# Altium schematic sheet MID_CURR_MOS.SchDoc
size A4; SheetNumber: 7; SheetTotal: 14
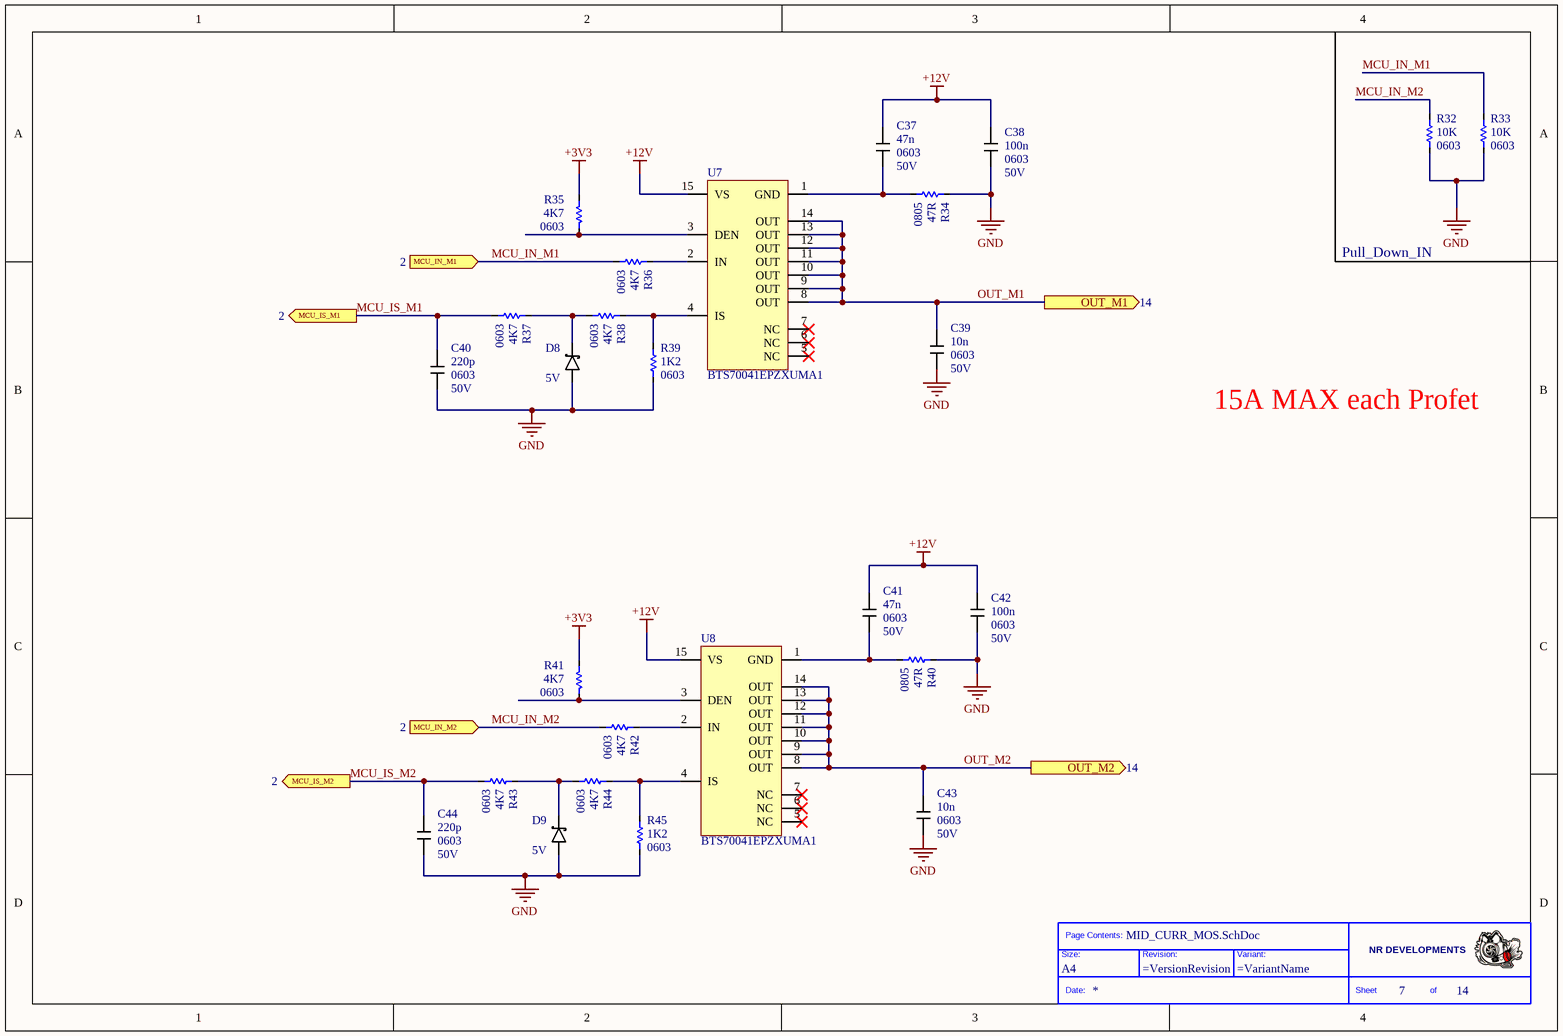
[diagram p0: MID_CURR_MOS.SchDoc]

## Parts
*?  Size: A4  (hidden comment: Title_Block)  (graphical)
C37  value 47n  Case: 0603  Voltage: 50V  [CAPC1608X09M]  (hidden comment: CAP)
C38  value 100n  Case: 0603  Voltage: 50V  [CAPC1608X09M]  (hidden comment: CAP)
C39  value 10n  Case: 0603  Voltage: 50V  [CAPC1608X09M]  (hidden comment: CAP)
C40  value 220p  Case: 0603  Voltage: 50V  [CAPC1608X09M]  (hidden comment: CAP)
C41  value 47n  Case: 0603  Voltage: 50V  [CAPC1608X09M]  (hidden comment: CAP)
C42  value 100n  Case: 0603  Voltage: 50V  [CAPC1608X09M]  (hidden comment: CAP)
C43  value 10n  Case: 0603  Voltage: 50V  [CAPC1608X09M]  (hidden comment: CAP)
C44  value 220p  Case: 0603  Voltage: 50V  [CAPC1608X09M]  (hidden comment: CAP)
D8  value 5V  [SOT65P210X100-3N - AC]  (hidden comment: Diode_Schottky)
D9  value 5V  [SOT65P210X100-3N - AC]  (hidden comment: Diode_Schottky)
R32  value 10K  Case: 0603  [RESC1608X06M]  (hidden comment: Res)
R33  value 10K  Case: 0603  [RESC1608X06M]  (hidden comment: Res)
R34  value 47R  Case: 0805  [RESC2012X06N]  (hidden comment: Res)
R35  value 4K7  Case: 0603  [RESC1608X06M]  (hidden comment: Res)
R36  value 4K7  Case: 0603  [RESC1608X06M]  (hidden comment: Res)
R37  value 4K7  Case: 0603  [RESC1608X06M]  (hidden comment: Res)
R38  value 4K7  Case: 0603  [RESC1608X06M]  (hidden comment: Res)
R39  value 1K2  Case: 0603  [RESC1608X06M]  (hidden comment: Res)
R40  value 47R  Case: 0805  [RESC2012X06N]  (hidden comment: Res)
R41  value 4K7  Case: 0603  [RESC1608X06M]  (hidden comment: Res)
R42  value 4K7  Case: 0603  [RESC1608X06M]  (hidden comment: Res)
R43  value 4K7  Case: 0603  [RESC1608X06M]  (hidden comment: Res)
R44  value 4K7  Case: 0603  [RESC1608X06M]  (hidden comment: Res)
R45  value 1K2  Case: 0603  [RESC1608X06M]  (hidden comment: Res)
U7  BTS70041EPZXUMA1  [SOP65P600X115-15]
U8  BTS70041EPZXUMA1  [SOP65P600X115-15]

## Ports
MCU_IN_M1 (in, see 2), MCU_IN_M2 (in, see 2), MCU_IS_M1 (out, see 2), MCU_IS_M2 (out, see 2), OUT_M1 (out, see 14), OUT_M2 (out, see 14)

## Nets
+3V3: R35.2 R41.2
+12V: C37.1 C38.1 C41.1 C42.1 U7.15(VS) U8.15(VS)
GND: C38.2 C39.2 C40.2 C42.2 C43.2 C44.2 D8.A D9.A R32.1 R33.1 R34.2 R39.1 R40.2 R45.1
MCU_IN_M1: R33.2 R36.1 ; port MCU_IN_M1
MCU_IN_M2: R32.2 R42.1 ; port MCU_IN_M2
MCU_IS_M1: C40.1 R37.1 ; port MCU_IS_M1
MCU_IS_M2: C44.1 R43.1 ; port MCU_IS_M2
OUT_M1: C39.1 U7.8(OUT) U7.9(OUT) U7.10(OUT) U7.11(OUT) U7.12(OUT) U7.13(OUT) U7.14(OUT) ; port OUT_M1
OUT_M2: C43.1 U8.8(OUT) U8.9(OUT) U8.10(OUT) U8.11(OUT) U8.12(OUT) U8.13(OUT) U8.14(OUT) ; port OUT_M2
NetC37_2: C37.2 R34.1 U7.1(GND)
NetC41_2: C41.2 R40.1 U8.1(GND)
NetD8_C: D8.C R37.2 R38.1
NetD9_C: D9.C R43.2 R44.1
NetR35_1: R35.1 U7.3(DEN)
NetR36_2: R36.2 U7.2(IN)
NetR38_2: R38.2 R39.2 U7.4(IS)
NetR41_1: R41.1 U8.3(DEN)
NetR42_2: R42.2 U8.2(IN)
NetR44_2: R44.2 R45.2 U8.4(IS)

Not connected (* = marked no-connect by the designer): U7 5(NC)* 6(NC)* 7(NC)*; U8 5(NC)* 6(NC)* 7(NC)*

## Notes on the sheet
- Pull_Down_IN
- 15A MAX each Profet
- (in symbol Title_Block) Page Contents:; NR DEVELOPMENTS; Size:; Revision:; Variant:; Date:; Sheet; of

## Library data of the parts
C37 C41 = CAP: Manufacturer: KEMET; PartNumber: C0603C473M5RACTU
C38 C42 = CAP: Manufacturer: KEMET; PartNumber: C0603C104K5RACTU
C39 C43 = CAP: Manufacturer: KEMET; PartNumber: C0603C103M5RACTM
C40 C44 = CAP: Manufacturer: KEMET; PartNumber: C0603C221J5RACTU
D8 D9 = Diode_Schottky: Manufacturer: Nexperia; PartNumber: BZX84W-C4V7-QX; Case: SOT-323-3
R32 R33 = Resistor: Manufacturer: YAGEO; PartNumber: AC0603FR-0710KL
R34 R40 = Resistor: Manufacturer: Vishay; PartNumber: CRCW080547R0FKEA
R35-R38 R41-R44 = Resistor: Manufacturer: YAGEO; PartNumber: RC0603FR-074K7L
R39 R45 = Resistor: Manufacturer: Vishay; PartNumber: CRCW06031K20FKEA
U7 U8 = BTS70041EPZXUMA1: Smart High-Side Power Switch 15A; Manufacturer: Infineon Technologies; PartNumber: BTS70041EPZXUMA1; Case: TSDSO-14; Value: BTS70041EPZXUMA1